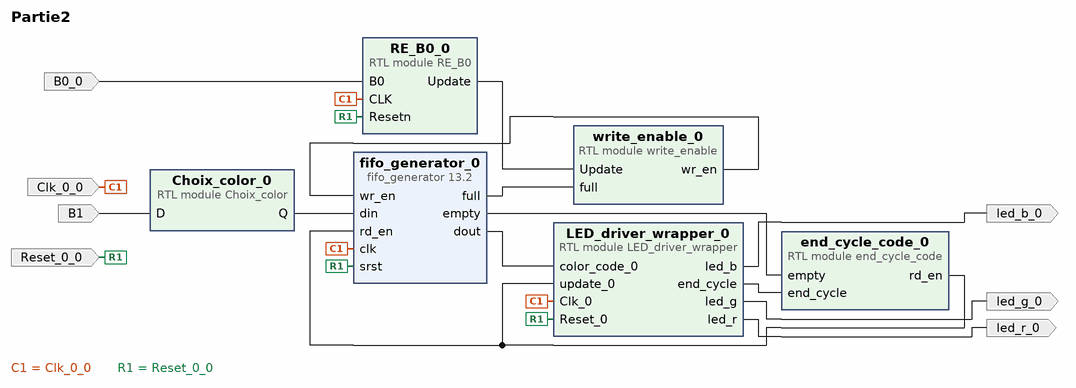
[diagram p0: block diagram of the top level]
# Vivado block design Partie2, xc7z010clg400-1, Vivado 2024.1
create_bd_design Partie2

create_bd_port -dir O led_b_0
create_bd_port -dir O led_g_0
create_bd_port -dir O led_r_0
create_bd_port -dir I Clk_0_0
create_bd_port -dir I -type rst Reset_0_0
create_bd_port -dir I B0_0
create_bd_port -dir I B1

create_bd_cell -type module -reference LED_driver_wrapper LED_driver_wrapper_0
create_bd_cell -type ip -vlnv xilinx.com:ip:fifo_generator:13.2 fifo_generator_0
set_property -dict {CONFIG.Input_Data_Width 2 CONFIG.Input_Depth 16 CONFIG.Output_Data_Width 2} [get_bd_cells fifo_generator_0]
create_bd_cell -type module -reference RE_B0 RE_B0_0
create_bd_cell -type module -reference Choix_color Choix_color_0
create_bd_cell -type module -reference write_enable write_enable_0
create_bd_cell -type module -reference end_cycle_code end_cycle_code_0

# ---- connections ----

connect_bd_net -net B0_0_1 [get_bd_ports B0_0] [get_bd_pins RE_B0_0/B0]
connect_bd_net [get_bd_pins Choix_color_0/Q] [get_bd_pins fifo_generator_0/din]
connect_bd_net -net Clk_0_0_1 [get_bd_ports Clk_0_0] \
  [get_bd_pins fifo_generator_0/clk] [get_bd_pins RE_B0_0/CLK] [get_bd_pins LED_driver_wrapper_0/Clk_0]
connect_bd_net -net D_0_1 [get_bd_ports B1] [get_bd_pins Choix_color_0/D]
connect_bd_net [get_bd_pins LED_driver_wrapper_0/end_cycle] [get_bd_pins end_cycle_code_0/end_cycle]
connect_bd_net [get_bd_pins LED_driver_wrapper_0/led_b] [get_bd_ports led_b_0]
connect_bd_net [get_bd_pins LED_driver_wrapper_0/led_g] [get_bd_ports led_g_0]
connect_bd_net [get_bd_pins LED_driver_wrapper_0/led_r] [get_bd_ports led_r_0]
connect_bd_net [get_bd_pins RE_B0_0/Update] [get_bd_pins write_enable_0/Update]
connect_bd_net -net Reset_0_0_1 [get_bd_ports Reset_0_0] \
  [get_bd_pins fifo_generator_0/srst] [get_bd_pins RE_B0_0/Resetn] [get_bd_pins LED_driver_wrapper_0/Reset_0]
connect_bd_net -net end_cycle_0_rd_en [get_bd_pins end_cycle_code_0/rd_en] \
  [get_bd_pins fifo_generator_0/rd_en] [get_bd_pins LED_driver_wrapper_0/update_0]
connect_bd_net [get_bd_pins fifo_generator_0/dout] [get_bd_pins LED_driver_wrapper_0/color_code_0]
connect_bd_net [get_bd_pins fifo_generator_0/empty] [get_bd_pins end_cycle_code_0/empty]
connect_bd_net [get_bd_pins fifo_generator_0/full] [get_bd_pins write_enable_0/full]
connect_bd_net [get_bd_pins write_enable_0/wr_en] [get_bd_pins fifo_generator_0/wr_en]

validate_bd_design
save_bd_design
